# Altium project Raptor.PrjPcb
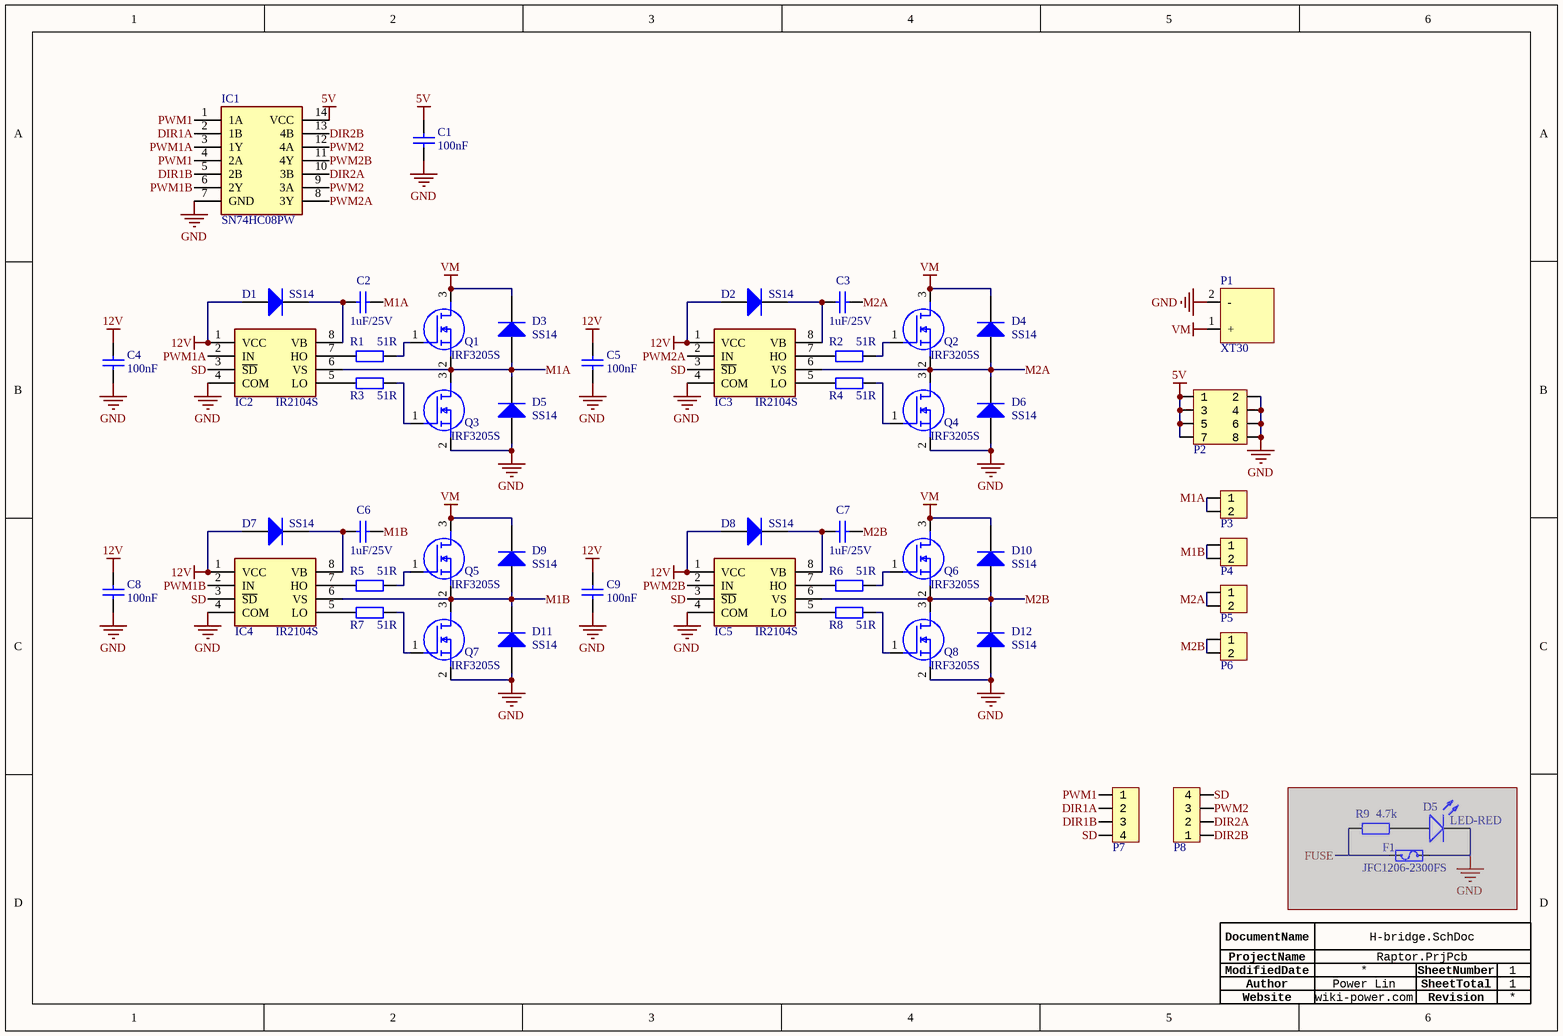
[diagram p0: H-bridge.SchDoc]
3 sheets, 80 parts. Net scope: global (net labels, ports and power ports of the same name join across sheets).
Board file: Raptor.PcbDoc
Sheets:
  H-bridge.SchDoc
  Buck-to-5V.SchDoc
  Boost-to-12V.SchDoc

## Sheet H-bridge.SchDoc
size 292 x 193 mm; Author: Power Lin; SheetNumber: 1; SheetTotal: 1; Website: wiki-power.com

### Parts
(Parts that share a designator on the sheet are numbered #1, #2 ... from top to bottom, then left to right.)
C1  100nF  [CAP-0603]
C2  1uF/25V  [CAP-0603]
C3  1uF/25V  [CAP-0603]
C4  100nF  [CAP-0603]
C5  100nF  [CAP-0603]
C6  1uF/25V  [CAP-0603]
C7  1uF/25V  [CAP-0603]
C8  100nF  [CAP-0603]
C9  100nF  [CAP-0603]
D1  SS14  [SOD_323]
D2  SS14  [SOD_323]
D3  SS14  [SOD_323]
D4  SS14  [SOD_323]
D5#1  SS14  [SOD_323]
D5#2  LED-RED  [LED-0603]  (masked out: inside a compile mask, not in the netlist)
D6  SS14  [SOD_323]
D7  SS14  [SOD_323]
D8  SS14  [SOD_323]
D9  SS14  [SOD_323]
D10  SS14  [SOD_323]
D11  SS14  [SOD_323]
D12  SS14  [SOD_323]
F1  JFC1206-2300FS  [FUSE_1206]  (masked out: inside a compile mask, not in the netlist)
IC1  SN74HC08PW  [TSSOP14]
IC2  IR2104S  [SOIC_8]
IC3  IR2104S  [SOIC_8]
IC4  IR2104S  [SOIC_8]
IC5  IR2104S  [SOIC_8]
P1  XT30  [XT60PW-M]
P2  HDR2x4_2.54  [HDR2X4_2.54_180H]  (value not drawn)
P3  HDR1x2_2.54  [HDR1X2_2.54_180]  (value not drawn)
P4  HDR1x2_2.54  [HDR1X2_2.54_180]  (value not drawn)
P5  HDR1x2_2.54  [HDR1X2_2.54_180]  (value not drawn)
P6  HDR1x2_2.54  [HDR1X2_2.54_180]  (value not drawn)
P7  HDR1x4_2.54  [HDR1x4_2.54_180]  (value not drawn)
P8  HDR1x4_2.54  [HDR1x4_2.54_180]  (value not drawn)
Q1  IRF3205S  [D2PAK-3]
Q2  IRF3205S  [D2PAK-3]
Q3  IRF3205S  [D2PAK-3]
Q4  IRF3205S  [D2PAK-3]
Q5  IRF3205S  [D2PAK-3]
Q6  IRF3205S  [D2PAK-3]
Q7  IRF3205S  [D2PAK-3]
Q8  IRF3205S  [D2PAK-3]
R1  51R  [R-0603]
R2  51R  [R-0603]
R3  51R  [R-0603]
R4  51R  [R-0603]
R5  51R  [R-0603]
R6  51R  [R-0603]
R7  51R  [R-0603]
R8  51R  [R-0603]
R9  4.7k  [R-0603]  (masked out: inside a compile mask, not in the netlist)

### Nets
5V: C1.2 IC1.14(VCC) P2.1 P2.3 P2.5 P2.7
12V: C4.2 C5.2 C8.2 C9.2 D1.1(A) D2.1(A) D7.1(A) D8.1(A) IC2.1(VCC) IC3.1(VCC) IC4.1(VCC) IC5.1(VCC)
GND: C1.1 C4.1 C5.1 C8.1 C9.1 D5#1.1(A) D6.1(A) D11.1(A) D12.1(A) IC1.7(GND) IC2.4(COM) IC3.4(COM) IC4.4(COM) IC5.4(COM) P1.2(-) P2.2 P2.4 P2.6 P2.8 Q3.2(S) Q4.2(S) Q7.2(S) Q8.2(S)
VM: D3.2(K) D4.2(K) D9.2(K) D10.2(K) P1.1(+) Q1.3(D) Q2.3(D) Q5.3(D) Q6.3(D)
DIR1A: IC1.2(1B) P7.2
DIR1B: IC1.5(2B) P7.3
DIR2A: IC1.10(3B) P8.2
DIR2B: IC1.13(4B) P8.1
M1A: C2.2 D3.1(A) D5#1.2(K) IC2.6(VS) P3.1 P3.2 Q1.2(S) Q3.3(D)
M1B: C6.2 D9.1(A) D11.2(K) IC4.6(VS) P4.1 P4.2 Q5.2(S) Q7.3(D)
M2A: C3.2 D4.1(A) D6.2(K) IC3.6(VS) P5.1 P5.2 Q2.2(S) Q4.3(D)
M2B: C7.2 D10.1(A) D12.2(K) IC5.6(VS) P6.1 P6.2 Q6.2(S) Q8.3(D)
PWM1: IC1.1(1A) IC1.4(2A) P7.1
PWM1A: IC1.3(1Y) IC2.2(IN)
PWM1B: IC1.6(2Y) IC4.2(IN)
PWM2: IC1.9(3A) IC1.12(4A) P8.3
PWM2A: IC1.8(3Y) IC3.2(IN)
PWM2B: IC1.11(4Y) IC5.2(IN)
SD: IC2.3(~{SD}) IC3.3(~{SD}) IC4.3(~{SD}) IC5.3(~{SD}) P7.4 P8.4
NetC2_1: C2.1 D1.2(K) IC2.8(VB)
NetC3_1: C3.1 D2.2(K) IC3.8(VB)
NetC6_1: C6.1 D7.2(K) IC4.8(VB)
NetC7_1: C7.1 D8.2(K) IC5.8(VB)
NetIC2_5: IC2.5(LO) R3.1
NetIC2_7: IC2.7(HO) R1.1
NetIC3_5: IC3.5(LO) R4.1
NetIC3_7: IC3.7(HO) R2.1
NetIC4_5: IC4.5(LO) R7.1
NetIC4_7: IC4.7(HO) R5.1
NetIC5_5: IC5.5(LO) R8.1
NetIC5_7: IC5.7(HO) R6.1
NetQ1_1: Q1.1(G) R1.2
NetQ2_1: Q2.1(G) R2.2
NetQ3_1: Q3.1(G) R3.2
NetQ4_1: Q4.1(G) R4.2
NetQ5_1: Q5.1(G) R5.2
NetQ6_1: Q6.1(G) R6.2
NetQ7_1: Q7.1(G) R7.2
NetQ8_1: Q8.1(G) R8.2

### Notes on the sheet
- Author
- DocumentName
- ModifiedDate
- ProjectName
- SheetNumber
- SheetTotal
- Website
- Revision

### Library data of the parts
C1-C9 = CAP: 贴片电容; ComponentLink1Description: 供应商链接; ComponentLink1URL: http://www.szlcsc.com/product/details_53938.html; Package: 0402; Supplier: LC; SuppliersPartNumber: C52923
D1-D4 D5#1 D6-D12 = DIODE: 二极管; ComponentLink1Description: 供应商链接; ComponentLink1URL: http://www.szlcsc.com/product/details_23178.html; Package: SMA(DO-214AC); Supplier: LC; SuppliersPartNumber: C22452
D5#2 = LED: 发光二极管; pin to pad: A>1 K>2; ComponentLink1Description: 供应商链接; ComponentLink1URL: http://www.szlcsc.com/product/details_2663.html; Package: 0603; Supplier: LC; SuppliersPartNumber: C2290
F1 = Fuse: 一次性贴片保险丝
IC1 = SN74HC08PW: Integrated Circuit; Manufacturer_Name: Texas Instruments; Manufacturer_Part_Number: SN74HCT08PW; Datasheet Link: http://www.ti.com/lit/gpn/SN74HCT08; Height: 1.2mm; Mouser Part Number: 595-SN74HCT08PW; Mouser Price/Stock: https://www.mouser.co.uk/ProductDetail/Texas-Instruments/SN74HCT08PW?qs=7KMwW2o1%252BmRuz7pKtn1cmg%3D%3D; Arrow Part Number: SN74HCT08PW; Arrow Price/Stock: https://www.arrow.com/en/products/sn74hct08pw/texas-instruments
IC2-IC5 = IR2104S: Integrated Circuit; Manufacturer_Name: Infineon; Datasheet Link: http://www.infineon.com/dgdl/ir2104.pdf?fileId=5546d462533600a4015355c7c1c31671; Height: 1.75mm; Manufacturer_Part_Number: IR2104S
P1 = XT30/60
P2 = HDR2x4_2.54: Header
P3-P6 = HDR1x2_2.54: Header
P7 P8 = HDR1x4_2.54: Header
Q1-Q8 = N-MOS: N 沟道 MOS; Manufacturer_Name: Nexperia; Manufacturer_Part_Number: SI2302DS; Datasheet Link: https://assets.nexperia.com/documents/data-sheet/SI2302DS.pdf; Height: 1.1mm; Mouser Part Number: N/A; Mouser Price/Stock: https://www.mouser.com/Search/Refine.aspx?Keyword=N%2FA; RS Part Number: 7983053P; RS Price/Stock: http://uk.rs-online.com/web/p/products/7983053P
R1-R9 = RES: 贴片电阻; Package: 0805; Supplier: LC; SuppliersPartNumber: C17798

## Sheet Buck-to-5V.SchDoc
size 292 x 193 mm; Author: Power Lin; SheetNumber: 1; SheetTotal: 1; Website: wiki-power.com
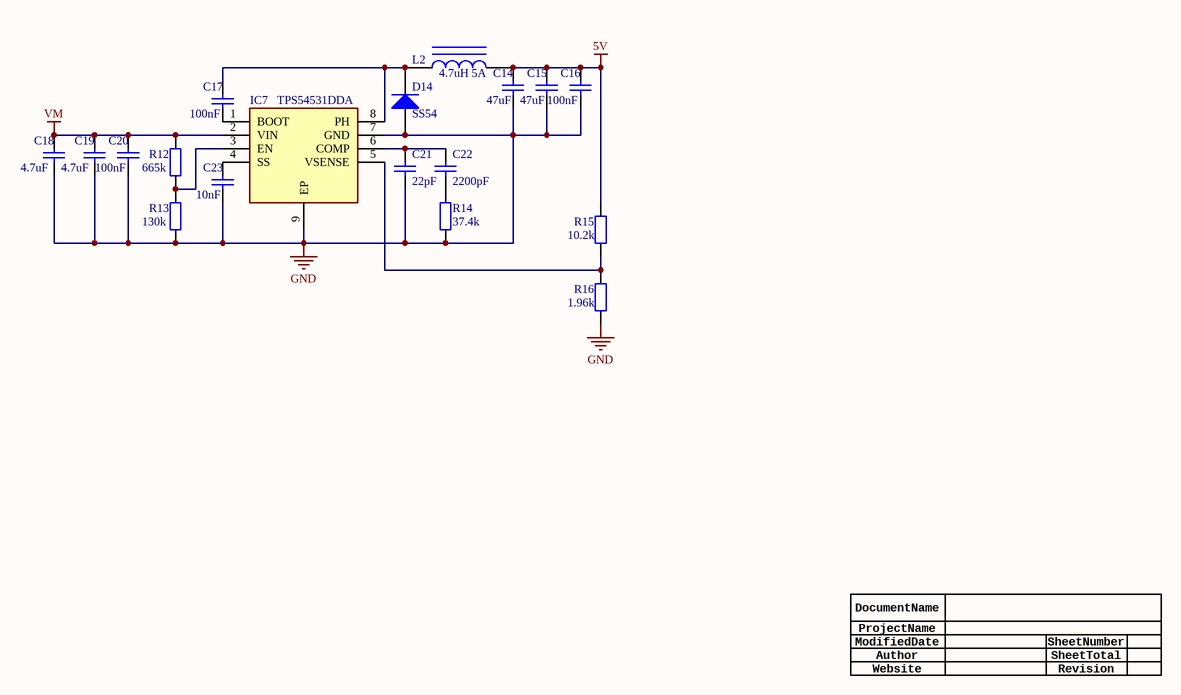
[diagram p1: Buck-to-5V.SchDoc]

### Parts
C14  47uF  [CAP-0603]
C15  47uF  [CAP-0603]
C16  100nF  [CAP-0603]
C17  100nF  [CAP-0603]
C18  4.7uF  [CAP-0603]
C19  4.7uF  [CAP-0603]
C20  100nF  [CAP-0603]
C21  22pF  [CAP-0603]
C22  2200pF  [CAP-0603]
C23  10nF  [CAP-0603]
D14  SS54  [DO-214AA/SMB]
IC7  TPS54531DDA  [SOIC_8_PAD]
L2  4.7uH 5A  [L-10040]
R12  665k  [R-0603]
R13  130k  [R-0603]
R14  37.4k  [R-0603]
R15  10.2k  [R-0603]
R16  1.96k  [R-0603]

### Nets
5V: C14.2 C15.2 C16.2 L2.2 R15.2
GND: C14.1 C15.1 C16.1 C18.1 C19.1 C20.1 C21.1 C23.1 D14.1(A) IC7.7(GND) IC7.9(EP) R13.1 R14.1 R16.1
VM: C18.2 C19.2 C20.2 IC7.2(VIN) R12.2
NetC17_1: C17.1 IC7.1(BOOT)
NetC17_2: C17.2 D14.2(K) IC7.8(PH) L2.1
NetC21_2: C21.2 C22.2 IC7.6(COMP)
NetC22_1: C22.1 R14.2
NetC23_2: C23.2 IC7.4(SS)
NetIC7_3: IC7.3(EN) R12.1 R13.2
NetIC7_5: IC7.5(VSENSE) R15.1 R16.2

### Notes on the sheet
- Author
- DocumentName
- ModifiedDate
- ProjectName
- SheetNumber
- SheetTotal
- Website
- Revision

### Library data of the parts
C14-C23 = CAP: 贴片电容; ComponentLink1Description: 供应商链接; ComponentLink1URL: http://www.szlcsc.com/product/details_53938.html; Package: 0402; Supplier: LC; SuppliersPartNumber: C52923
D14 = DIODE: 肖特基二极管; ComponentLink1Description: 供应商链接; ComponentLink1URL: http://www.szlcsc.com/product/details_23178.html; Package: SMA(DO-214AC); Supplier: LC; SuppliersPartNumber: C22452
IC7 = TPS54531DDA: 集成稳压芯片; Manufacturer_Name: Texas Instruments; Datasheet Link: http://www.ti.com/lit/gpn/tps54531; Height: 1.7mm; Manufacturer_Part_Number: TPS54531DDA; Mouser Part Number: 595-TPS54531DDA; Mouser Price/Stock: https://www.mouser.co.uk/ProductDetail/Texas-Instruments/TPS54531DDA?qs=jA5Ki6243omoJVKISZs%2FBg%3D%3D; Arrow Part Number: TPS54531DDA; Arrow Price/Stock: https://www.arrow.com/en/products/tps54531dda/texas-instruments
L2 = INDUCTOR: 电感; ComponentLink1Description: 供应商链接; ComponentLink1URL: http://www.szlcsc.com/product/details_33003.html; Package: 0402; Supplier: LC; SuppliersPartNumber: C32041
R12-R16 = RES: 贴片电阻; Package: 0805; Supplier: LC; SuppliersPartNumber: C17798

## Sheet Boost-to-12V.SchDoc
size 292 x 193 mm; Author: Power Lin; SheetNumber: 1; SheetTotal: 1; Website: wiki-power.com
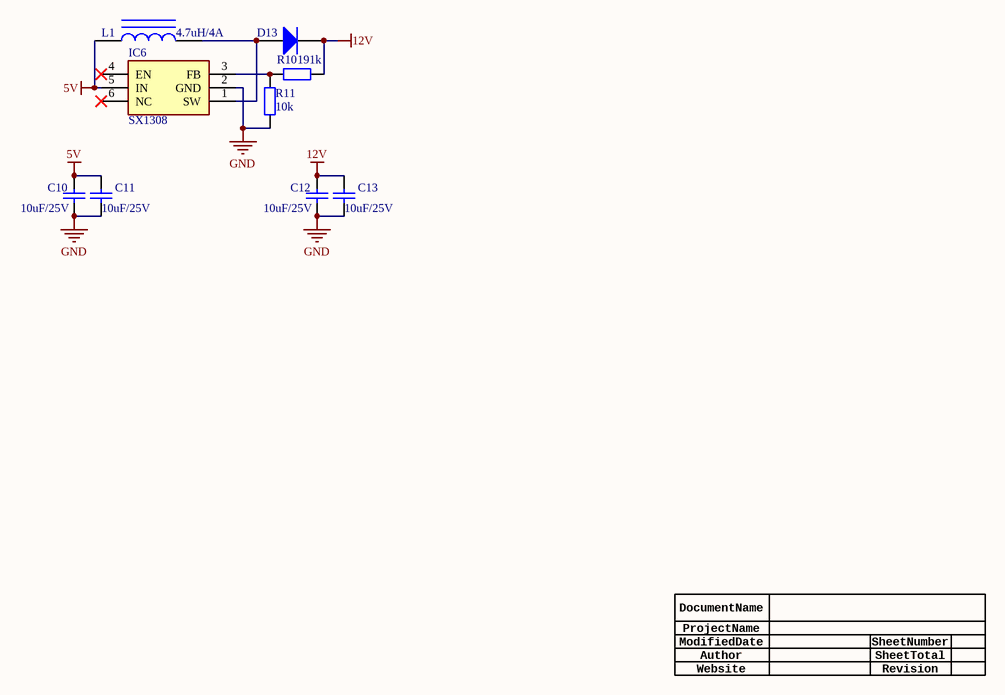
[diagram p2: Boost-to-12V.SchDoc]

### Parts
C10  10uF/25V  [CAP-0603]
C11  10uF/25V  [CAP-0603]
C12  10uF/25V  [CAP-0603]
C13  10uF/25V  [CAP-0603]
D13  SS34  [DO-214AC/SMA]  (value not drawn)
IC6  SX1308  [SOT-23-6]
L1  4.7uH/4A  [SMD_7.3x7.3x4.2mm]
R10  191k  [R-0603]
R11  10k  [R-0603]

### Nets
5V: C10.2 C11.2 IC6.5(IN) L1.1
12V: C12.2 C13.2 D13.2(K) R10.2
GND: C10.1 C11.1 C12.1 C13.1 IC6.2(GND) R11.1
NetD13_1: D13.1(A) IC6.1(SW) L1.2
NetIC6_3: IC6.3(FB) R10.1 R11.2

Not connected (* = marked no-connect by the designer): IC6 4(EN)* 6(NC)*

### Notes on the sheet
- Author
- DocumentName
- ModifiedDate
- ProjectName
- SheetNumber
- SheetTotal
- Website
- Revision

### Library data of the parts
C10-C13 = CAP: X7R; ComponentLink1Description: 供应商链接; ComponentLink1URL: http://www.szlcsc.com/product/details_53938.html; Package: 0402; Supplier: LC; SuppliersPartNumber: C52923
D13 = DIODE: 二极管; ComponentLink1Description: 供应商链接; ComponentLink1URL: http://www.szlcsc.com/product/details_23178.html; Package: SMA(DO-214AC); Supplier: LC; SuppliersPartNumber: C22452
IC6 = SX1308: 集成升压芯片; Manufacturer_Name: Shenzhen Suosemi Tech; Datasheet Link: https://datasheet.lcsc.com/szlcsc/Shenzhen-Suosemi-Tech-SX1308_C78162.pdf; Height: 1.45mm; Manufacturer_Part_Number: SX1308
L1 = INDUCTOR: 电感; ComponentLink1Description: 供应商链接; ComponentLink1URL: http://www.szlcsc.com/product/details_33003.html; Package: 0402; Supplier: LC; SuppliersPartNumber: C32041
R10 R11 = RES: 贴片电阻; Package: 0805; Supplier: LC; SuppliersPartNumber: C17798

## Nets that join several sheets
5V: H-bridge (6 pins), Buck-to-5V (5 pins), Boost-to-12V (C10.2 C11.2 IC6.5 L1.1)
12V: H-bridge (12 pins), Boost-to-12V (C12.2 C13.2 D13.2 R10.2)
GND: H-bridge (23 pins), Buck-to-5V (14 pins), Boost-to-12V (6 pins)
VM: H-bridge (9 pins), Buck-to-5V (5 pins)